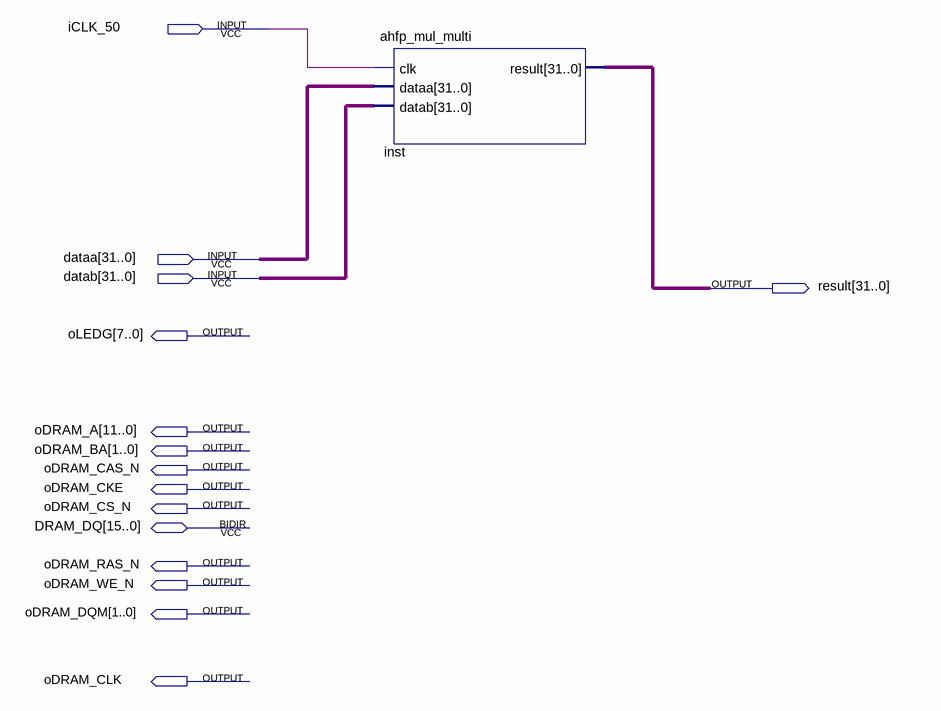
[diagram p0: schematic sheet]
// Quartus schematic hello_world.bdf as structural Verilog: 1 symbols, 15 pins
module hello_world (
  input  iCLK_50,
  input  [31:0] dataa,
  input  [31:0] datab,
  inout  [15:0] DRAM_DQ,
  output [31:0] result,
  output [7:0] oLEDG,
  output [11:0] oDRAM_A,
  output [1:0] oDRAM_BA,
  output oDRAM_CAS_N,
  output oDRAM_CKE,
  output oDRAM_CS_N,
  output oDRAM_RAS_N,
  output oDRAM_WE_N,
  output [1:0] oDRAM_DQM,
  output oDRAM_CLK
);

  ahfp_mul_multi inst (.clk(iCLK_50), .dataa(dataa), .datab(datab), .result(result));
endmodule
